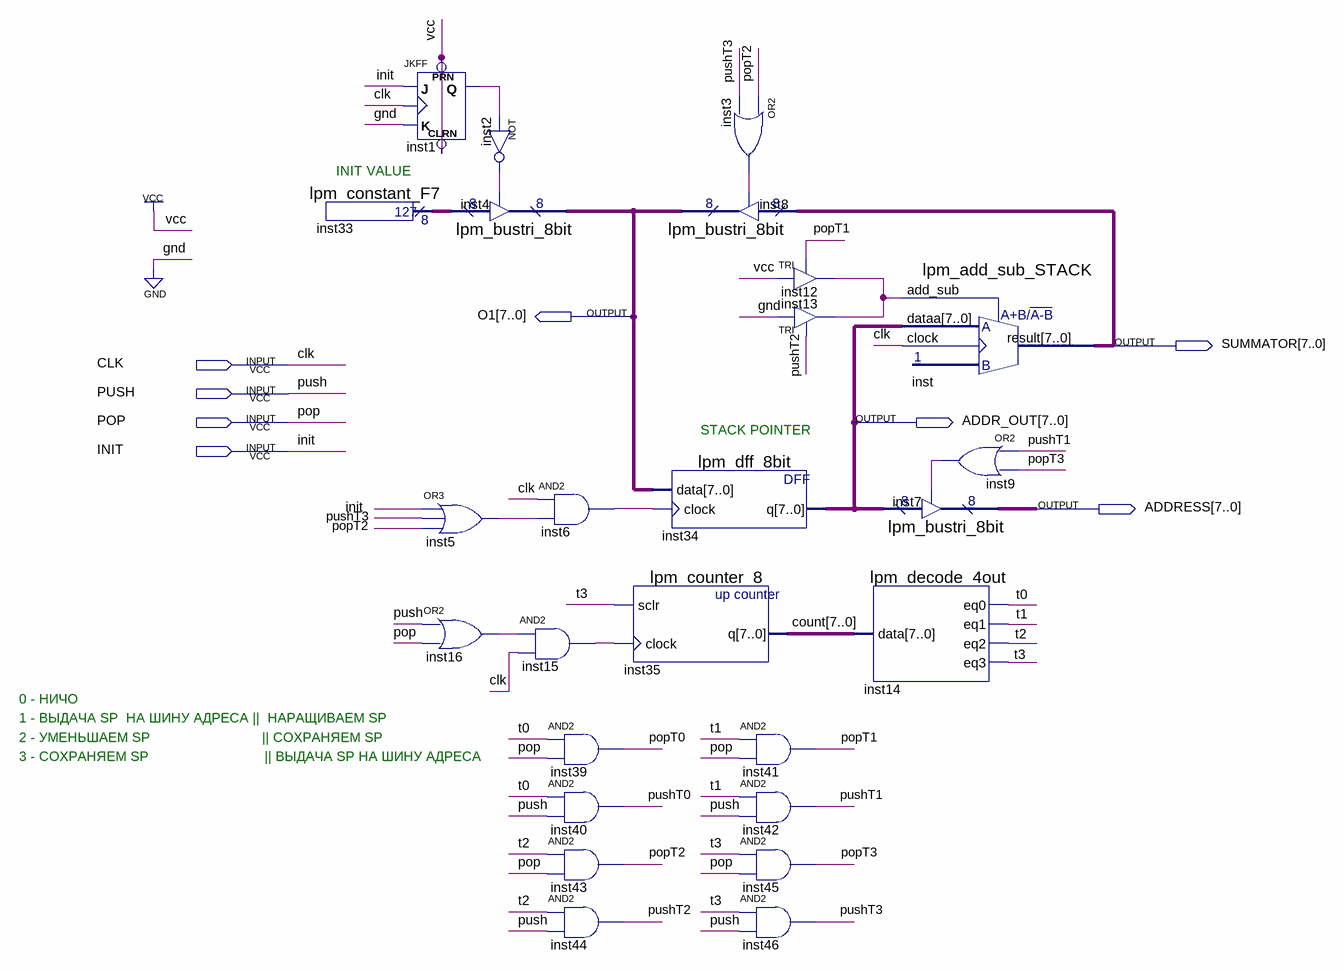
[diagram p0: schematic sheet]
// Quartus schematic Stack.bdf as structural Verilog: 26 symbols, 8 pins
module Stack (
  input  CLK,
  input  PUSH,
  input  POP,
  input  INIT,
  output [7:0] O1,
  output [7:0] SUMMATOR,
  output [7:0] ADDR_OUT,
  output [7:0] ADDRESS
);

  wire inst1_q, inst2_out, inst3_out, inst5_out, inst6_out, inst9_out, inst12_out, inst15_out, inst16_out,
       popT0, popT1, popT2, popT3, pushT0, pushT1, pushT2, pushT3, t0, t1, t2, t3;
  wire [7:0] count, inst33_result;

  lpm_constant_F7 inst33 (.result(inst33_result));
  JKFF inst1 (.PRN(1'b1), .CLRN(1'b1), .K(1'b0), .J(INIT), .CLK(CLK), .Q(inst1_q));
  lpm_bustri_8bit inst4 (.enabledt(inst2_out), .data(inst33_result), .tridata(O1));
  or inst5 (inst5_out, INIT, pushT3, popT2);
  or inst16 (inst16_out, PUSH, POP);
  not inst2 (inst2_out, inst1_q);
  and inst15 (inst15_out, inst16_out, CLK);
  and inst6 (inst6_out, CLK, inst5_out);
  and inst39 (popT0, t0, POP);
  and inst40 (pushT0, t0, PUSH);
  and inst43 (popT2, t2, POP);
  and inst44 (pushT2, t2, PUSH);
  lpm_bustri_8bit inst8 (.enabledt(inst3_out), .data(SUMMATOR), .tridata(O1));
  lpm_dff_8bit inst34 (.data(O1), .clock(inst6_out), .q(ADDR_OUT));
  lpm_counter_8 inst35 (.sclr(t3), .clock(inst15_out), .q(count));
  or inst3 (inst3_out, popT2, pushT3);
  and inst41 (popT1, t1, POP);
  and inst42 (pushT1, t1, PUSH);
  and inst45 (popT3, t3, POP);
  and inst46 (pushT3, t3, PUSH);
  TRI inst12 (.IN(1'b1), .OE(popT1), .OUT(inst12_out));
  TRI inst13 (.IN(1'b0), .OE(pushT2), .OUT(inst12_out));
  lpm_add_sub_STACK inst (.dataa(ADDR_OUT), .clock(CLK), .add_sub(inst12_out), .result(SUMMATOR));
  lpm_bustri_8bit inst7 (.enabledt(inst9_out), .data(ADDR_OUT), .tridata(ADDRESS));
  lpm_decode_4out inst14 (.data(count), .eq0(t0), .eq1(t1), .eq2(t2), .eq3(t3));
  or inst9 (inst9_out, pushT1, popT3);

  // Notes on the sheet:
  //   INIT VALUE
  //   STACK POINTER
  //   0 - НИЧО
  //   1 - ВЫДАЧА SP  НА ШИНУ АДРЕСА ||  НАРАЩИВАЕМ SP
  //   2 - УМЕНЬШАЕМ SP                            || СОХРАНЯЕМ SP
  //   3 - СОХРАНЯЕМ SP                             || ВЫДАЧА SP НА ШИНУ АДРЕСА
endmodule
